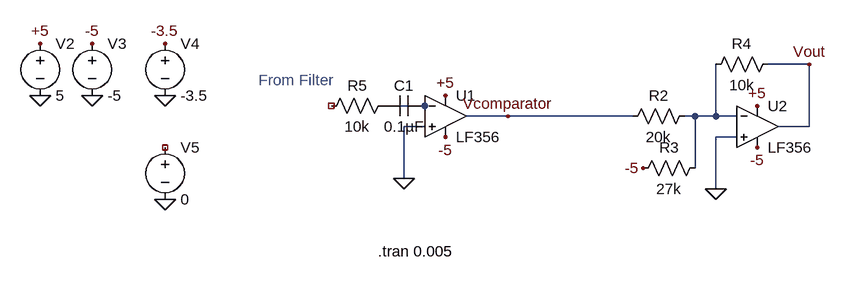
[diagram p0: schematic AnalogToDigital.asc]
AnalogToDigital.asc, the LTspice schematic file:
Version 4
SHEET 1 1200 680
WIRE 800 32 736 32
WIRE 208 96 160 96
WIRE 336 112 272 112
WIRE 528 112 336 112
WIRE 624 112 608 112
WIRE 656 112 656 32
WIRE 656 112 624 112
WIRE 688 112 656 112
WIRE 208 128 176 128
WIRE 800 128 800 32
WIRE 800 128 752 128
WIRE 688 144 656 144
WIRE 624 192 624 112
WIRE 176 208 176 128
WIRE 656 224 656 144
FLAG -384 80 0
FLAG -304 80 0
FLAG -384 0 +5
FLAG 240 80 +5
FLAG -304 0 -5
FLAG 240 144 -5
FLAG 656 224 0
FLAG 720 96 +5
FLAG 720 160 -5
FLAG 176 208 0
FLAG -192 80 0
FLAG -192 0 -3.5
FLAG 544 192 -5
FLAG -192 240 0
FLAG 336 112 Vcomparator
FLAG 800 32 Vout
SYMBOL OpAmps\\LF356 240 48 R0
SYMATTR InstName U1
SYMBOL voltage -384 -16 R0
WINDOW 123 0 0 Left 0
WINDOW 39 0 0 Left 0
SYMATTR InstName V2
SYMATTR Value 5
SYMBOL voltage -304 -16 R0
WINDOW 123 0 0 Left 0
WINDOW 39 0 0 Left 0
SYMATTR InstName V3
SYMATTR Value -5
SYMBOL OpAmps\\LF356 720 64 R0
SYMATTR InstName U2
SYMBOL res 624 96 R90
WINDOW 0 0 56 VBottom 2
WINDOW 3 32 56 VTop 2
SYMATTR InstName R2
SYMATTR Value 20k
SYMBOL res 752 16 R90
WINDOW 0 0 56 VBottom 2
WINDOW 3 32 56 VTop 2
SYMATTR InstName R4
SYMATTR Value 10k
SYMBOL res 640 176 R90
WINDOW 0 0 56 VBottom 2
WINDOW 3 32 56 VTop 2
SYMATTR InstName R3
SYMATTR Value 27k
SYMBOL voltage -192 -16 R0
WINDOW 123 0 0 Left 0
WINDOW 39 0 0 Left 0
SYMATTR InstName V4
SYMATTR Value -3.5
SYMBOL res 160 80 R90
WINDOW 0 0 56 VBottom 2
WINDOW 3 32 56 VTop 2
SYMATTR InstName R5
SYMATTR Value 10k
SYMBOL cap 208 80 R90
WINDOW 0 0 32 VBottom 2
WINDOW 3 32 32 VTop 2
SYMATTR InstName C1
SYMATTR Value 0.1µF
SYMBOL voltage -192 144 R0
WINDOW 123 0 0 Left 0
WINDOW 39 0 0 Left 0
SYMATTR InstName V5
SYMATTR Value 0
TEXT 136 320 Left 2 !.tran 0.005
TEXT -48 56 Left 2 ;From Filter

The netlist it stands for:
* AnalogToDigital.asc
XU1 0 N001 +5 -5 Vcomparator LF356  ; pins In+ In- V+ V- OUT
V2 +5 0 5
V3 -5 0 -5
XU2 0 N002 +5 -5 Vout LF356  ; pins In+ In- V+ V- OUT
R2 N002 Vcomparator 20k
R4 Vout N002 10k
R3 N002 -5 27k
V4 -3.5 0 -3.5
R5 P001 NC_01 10k
C1 N001 P001 0.1µF
V5 NC_02 0 0
.tran 0.005
* From Filter
.lib LF356.sub
.backanno
.end